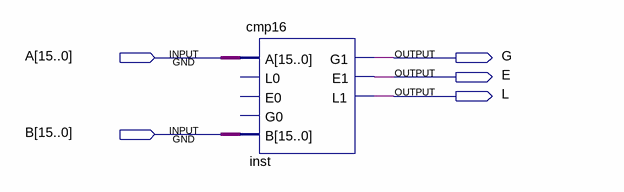
[diagram p0: schematic sheet]
// Quartus schematic cmp16u.bdf as structural Verilog: 1 symbols, 5 pins
module cmp16u (
  input  [15:0] A,
  input  [15:0] B,
  output G,
  output E,
  output L
);

  cmp16 inst (.A(A), .B(B), .G1(G), .E1(E), .L1(L));  // open: L0, E0, G0
endmodule
